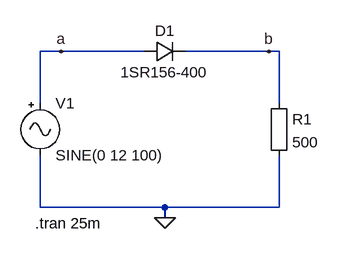
[diagram p0: schematic RHV-P3.asc]
RHV-P3.asc, the LTspice schematic file:
Version 4
SHEET 1 880 680
WIRE -240 112 -272 112
WIRE -112 112 -240 112
WIRE 80 112 -48 112
WIRE 96 112 80 112
WIRE -272 192 -272 112
WIRE 96 192 96 112
WIRE -272 352 -272 272
WIRE -80 352 -272 352
WIRE 96 352 96 272
WIRE 96 352 -80 352
WIRE -80 368 -80 352
FLAG -80 368 0
FLAG -240 112 a
FLAG 80 112 b
SYMBOL diode -112 128 R270
WINDOW 0 32 32 VTop 2
WINDOW 3 0 32 VBottom 2
SYMATTR InstName D1
SYMATTR Value 1SR156-400
SYMBOL Misc\\EuropeanResistor 80 176 R0
SYMATTR InstName R1
SYMATTR Value 500
SYMBOL Misc\\signal -272 176 R0
WINDOW 123 0 0 Left 2
WINDOW 39 0 0 Left 2
SYMATTR InstName V1
SYMATTR Value SINE(0 12 100)
TEXT -280 376 Left 2 !.tran 25m

The netlist it stands for:
* RHV-P3.asc
D1 a b 1SR156-400
R1 b 0 500
V1 a 0 SINE(0 12 100)
.model D D
.lib standard.dio
.tran 25m
.backanno
.end